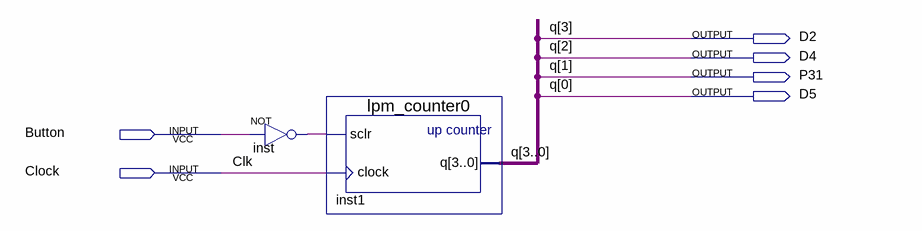
[diagram p0: schematic sheet]
// Quartus schematic Blink2.bdf as structural Verilog: 2 symbols, 6 pins
module Blink2 (
  input  Button,
  input  Clock,
  output D2,
  output D4,
  output P31,
  output D5
);

  wire inst_out;

  not inst (inst_out, Button);
  lpm_counter0 inst1 (.sclr(inst_out), .clock(Clock), .q({D2, D4, P31, D5}));

  // Other names for the same wires on the sheet: Clk = Clock; q[3:0] = {D2, D4, P31, D5}
endmodule
